# EAGLE design v1 (EAGLE 8.3.2)
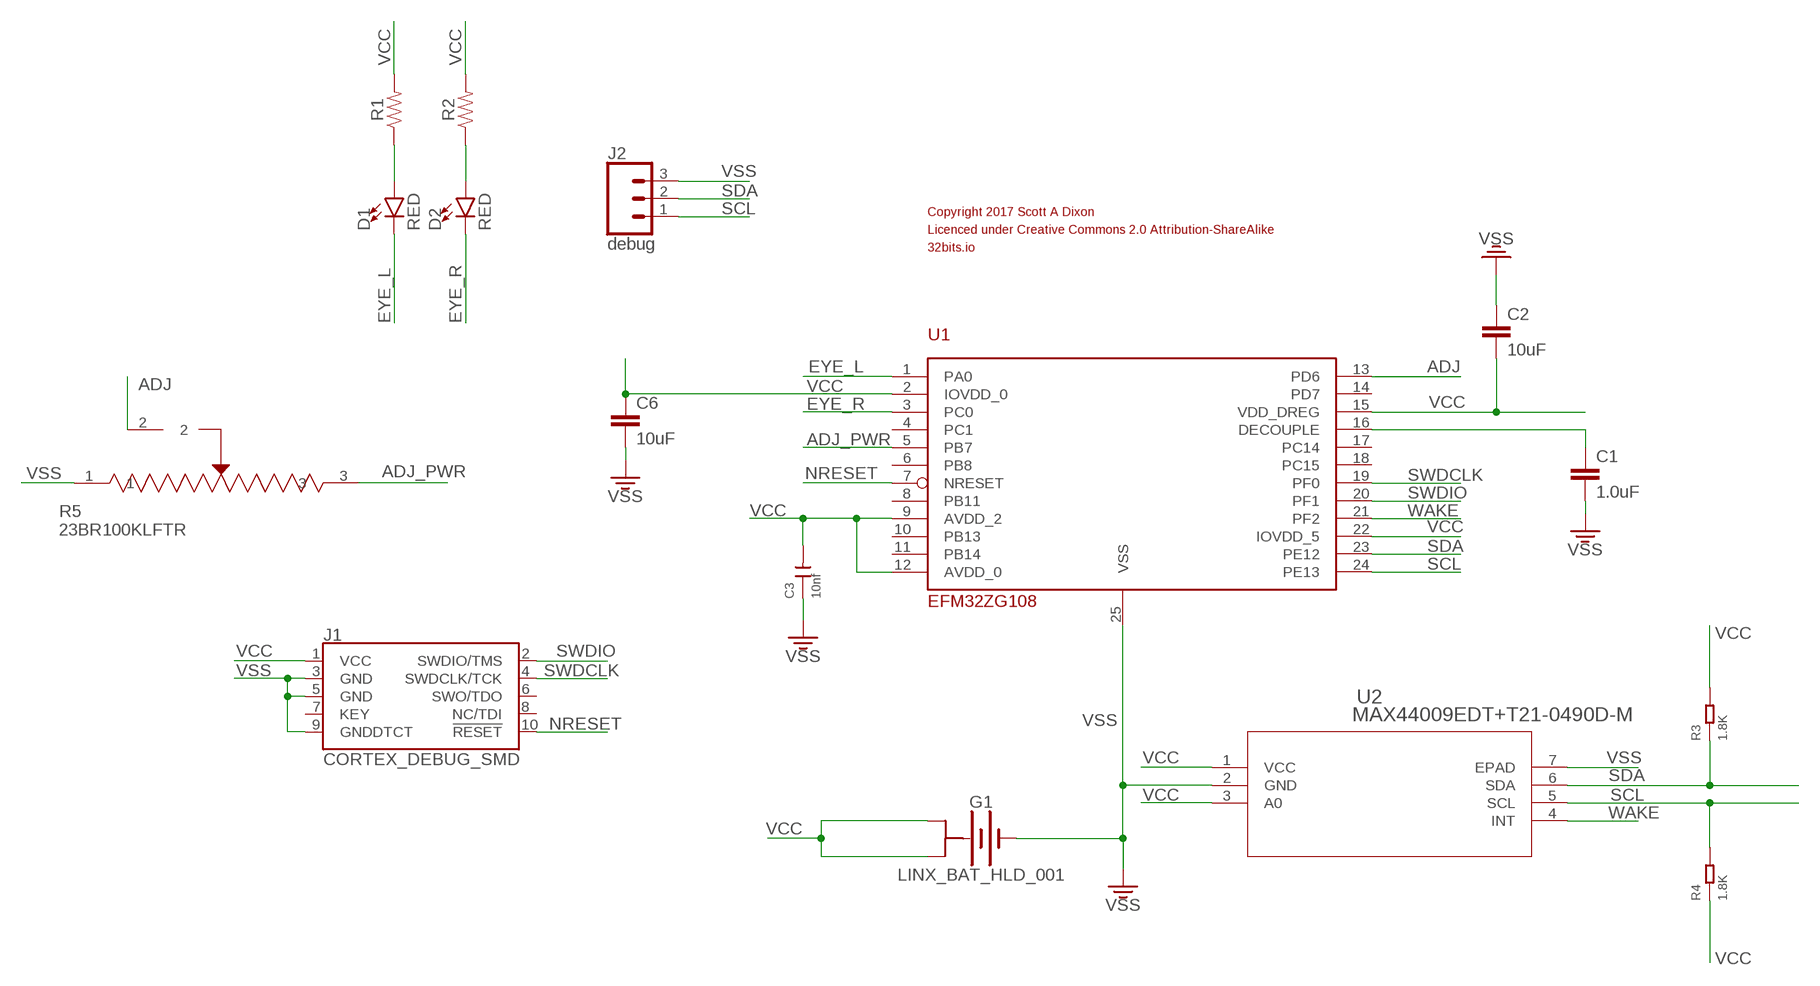
[diagram p0: schematic, sheet 1]

## Parts
C1  1.0uF  1.0UF-0603-16V-10%  [0603]
C2  10uF  10UF-0805-10V-10%  [0805]
C3  10nf  CERAMIC-10NF-50V-10%-X7R(0402)  [C0402]
C6  10uF  10UF-0805-10V-10%  [0805]
D1  RED  LED-RED1206  [LED-1206]
D2  RED  LED-RED1206  [LED-1206]
G1  LINX_BAT_HLD_001  [BATT-RETAINER-20MM]
J1  CORTEX_DEBUG_SMD  [SAMTECH_FTSH-105-01]
J2  debug  CONN_03  [1X03]
R1  68OHM-0603-1/10W-1%  [0603]
R2  68OHM-0603-1/10W-1%  [0603]
R3  1.8K  SMD-RES-1K-5%-1/16W(0402)  [R0402]
R4  1.8K  SMD-RES-1K-5%-1/16W(0402)  [R0402]
R5  23BR100KLFTR  [SOT_23BR100KLFTR]
U1  EFM32ZG108  [QFN-24]
U2  MAX44009EDT+T21-0490D-M  [21-0490D-M]
U$1  COPYRIGHT  [COPYRIGHT]

## Nets
ADJ: R5.2 U1.13(PD6)
ADJ_PWR: R5.3 U1.5(PB7)
DCP: C1.1 U1.16(DECOUPLE)
EYE_L: D1.C U1.1(PA0)
EYE_R: D2.C U1.3(PC0)
N$2: D2.A R2.1
N$3: D1.A R1.1
NRESET: J1.10(!RESET) U1.7(NRESET)
SCL: J2.1 R4.2 U1.24(PE13) U2.5(SCL)
SDA: J2.2 R3.1 U1.23(PE12) U2.6(SDA)
SWDCLK: J1.4(SWDCLK/TCK) U1.19(PF0)
SWDIO: J1.2(SWDIO/TMS) U1.20(PF1)
VCC: C2.2 C3.2 C6.1 G1.P$1(+$1) G1.P$2(+$1) G1.P$3(+$2) G1.P$4(+$2) J1.1(VCC) R1.2 R2.2 R3.2 R4.1 U1.2(IOVDD_0) U1.9(AVDD_2) U1.12(AVDD_0) U1.15(VDD_DREG) U1.22(IOVDD_5) U2.1(VCC) U2.3(A0)
VSS: C1.2 C2.1 C3.1 C6.2 G1.P$0(-) J1.3(GND) J1.5(GND) J1.9(GNDDTCT) J2.3 R5.1 U1.25(VSS) U2.2(GND) U2.7(EPAD)
WAKE: U1.21(PF2) U2.4(INT)
Unconnected: J1.6(SWO/TDO) J1.7(KEY) J1.8(NC/TDI) U1.4(PC1) U1.6(PB8) U1.8(PB11) U1.10(PB13) U1.11(PB14) U1.14(PD7) U1.17(PC14) U1.18(PC15)

## Library data of the parts
C1 = SparkFun-Capacitors:1.0UF: 1µF ceramic capacitors A capacitor is a passive two-terminal electrical component used to store electrical energy temporarily in an electric field.; PROD_ID: CAP-00868
C2 C6 = SparkFun-Capacitors:10UF: 10.0µF ceramic capacitors A capacitor is a passive two-terminal electrical component used to store electrical energy temporarily in an electric field.; PROD_ID: CAP-11330
C3 = Seeed-Capacitor:CERAMIC-10NF-50V-10%-X7R(0402): 302010006; MPN: CC0402KRX7R9BB103
D1 D2 = SparkFun-LED:LED-RED: Red SMD LED Used in manufacturing of most products at SparkFun Packages: 0603 - SMD 0603 package [Product Link] <http://docs.avagotech.com/docs/AV02-0551EN> 0603 SMART - SMD 0603 SMART package ( more efficient and expensive)[Product Link] <http://www.osram-os.com/Graphics/XPic2/00077099_0.pdf> 1206 - SMD1206 package [Product Link] <https://www.sparkfun.com/datasheets/DevTools/LilyPad/Q150OVS4.pdff> SparkFun Products: Pro Mini 328 -5V <https://www.sparkfun.com/products/821> RedBoard <https://www.sparkfun.com/products/12757> IOIO-OTG <https://www.sparkfun.com/products/13613>; PROD_ID: DIO-09912
G1 = boneyard:LINX_BAT_HLD_001
J1 = SparkFun-Connectors:CORTEX_DEBUG: Cortex Debug Connector - 10 pin Supports JTAG debug, Serial Wire debug, and Serial Wire Viewer. PTH and SMD connector options available. General Connector Information <http://infocenter.arm.com/help/topic/com.arm.doc.faqs/attached/13634/cortex_debug_connectors.pdf> Products: PTH Connector <http://www.digikey.com/product-detail/en/cnc-tech/3220-10-0100-00/1175-1627-ND/3883661> -via Digi-Key SparkFun PSoc <https://www.sparkfun.com/products/13229> SparkFun T <https://www.sparkfun.com/products/13810>
J2 = SparkFun-Connectors:CONN_03: Multi connection point. Often used as Generic Header-pin footprint for 0.1 inch spaced/style header connections On any of the 0.1 inch spaced packages, you can populate with these: Break Away Headers - Straight <https://www.sparkfun.com/products/116> (PRT-00116) Break Away Male Headers - Right Angle <https://www.sparkfun.com/products/553> (PRT-00553) Female Headers <https://www.sparkfun.com/products/115> (PRT-00115) Break Away Headers - Machine Pin <https://www.sparkfun.com/products/117> (PRT-00117) Break Away Female Headers - Swiss Machine Pin <https://www.sparkfun.com/products/743> (PRT-00743) Stackable Header - 3 Pin (Female, 0.1") <https://www.sparkfun.com/products/13875> (PRT-13875) For SCREWTERMINALS and SPRING TERMINALS visit here: Screw Terimnals on SparkFun.com <https://www.sparkfun.com/search/results?term=Screw+Terminals> (5mm/3.5mm/2.54mm spacing) This device is also useful as a general connection point to wire up your design to another part of your project. Our various solder wires solder well into these plated through hole pads. Hook-Up Wire - Assortment (Stranded, 22 AWG) <https://www.sparkfun.com/products/11375> (PRT-11375) Hook-Up Wire - Assortment (Solid Core, 22 AWG) <https://www.sparkfun.com/products/11367> (PRT-11367) View the entire wire category on our website here <https://www.sparkfun.com/categories/141> Special notes: Molex polarized connector foot print use with SKU : PRT-08232 with associated crimp pins and housings.
R1 R2 = SparkFun-Resistors:68OHM: 68Ω resistor A resistor is a passive two-terminal electrical component that implements electrical resistance as a circuit element. Resistors act to reduce current flow, and, at the same time, act to lower voltage levels within circuits. - Wikipedia
R3 R4 = Seeed-Resistor:SMD-RES-1K-5%-1/16W(0402): 301010006; MPN: RC0402JR-071KL; VALUE: 1K
R5 = boneyard:23BR100KLFTR; MANUFACTURER_PART_NUMBER: 23BR100KLFTR; VENDOR: Bi Technologies
U1 = boneyard:EFM32ZG108: EFM32 ARM Cortex-M0+ CPU platform up to 24 MHz 32/16/8/4 KB Flash 4/4/2/2 KB RAM
U2 = boneyard:MAX44009EDT+T; MANUFACTURER_PART_NUMBER: MAX44009EDT+T; VENDOR: Maxim Integrated Products
U$1 = boneyard:COPYRIGHT: Silkscreen and copyright for the damned board.

## Board
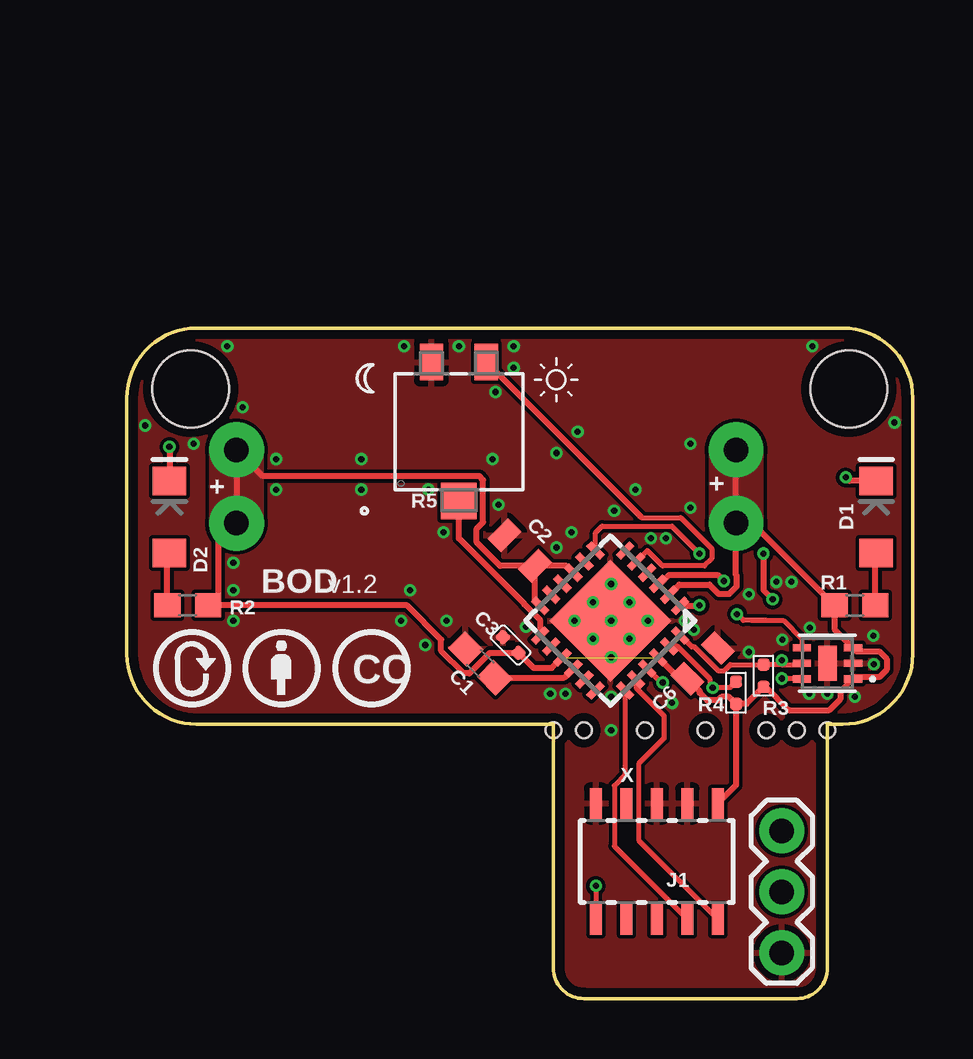
[diagram p1: board, top side]
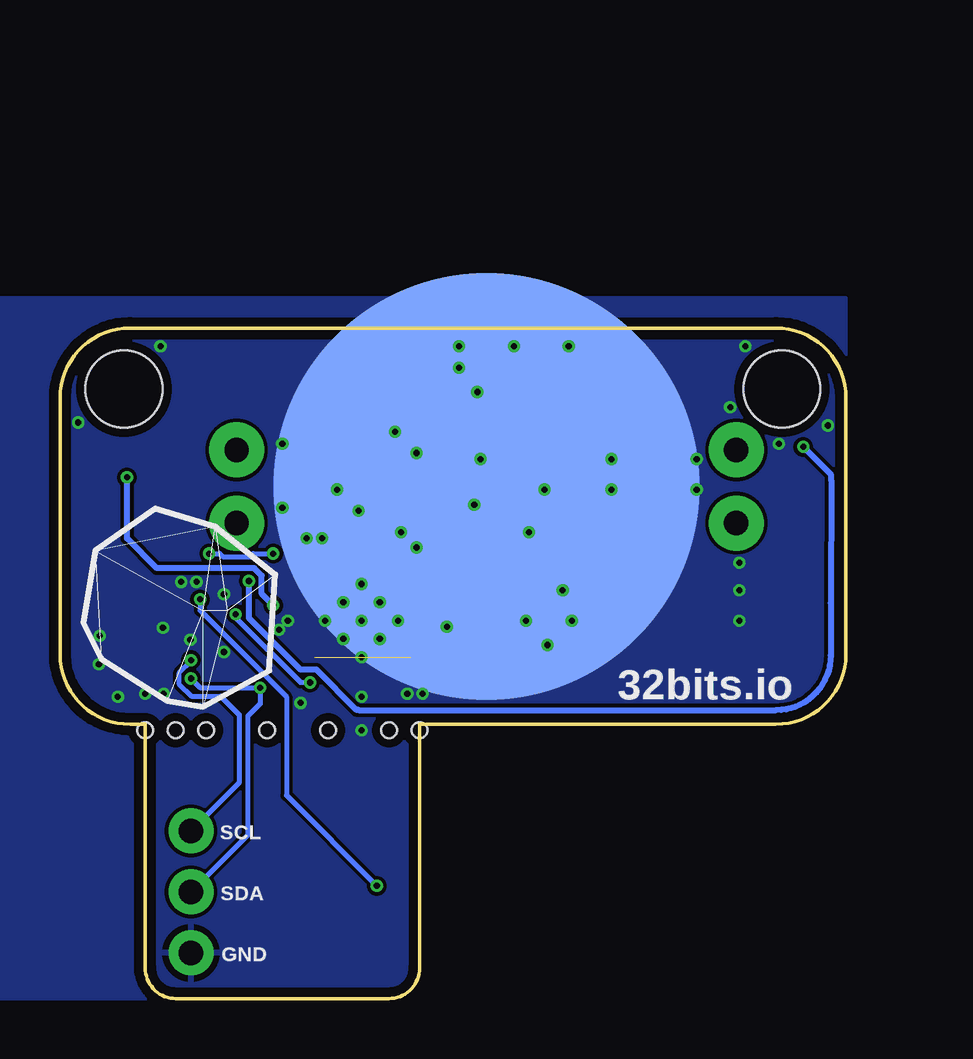
[diagram p2: board, bottom side, seen from below]

Size 32.77 x 27.94 mm. Coordinates in mm from the lower left corner, seen from the top.
Outline: 0,25.02 0,14.35 arc90 2.92,11.43 17.78,11.43 17.78,1.27 arc90 19.05,0 27.94,0 arc90 29.21,1.27 29.21,11.43 29.84,11.43 arc90 32.77,14.35 32.77,25.02 arc90 29.84,27.94 2.92,27.94 arc90 0,25.02
Copper layers (1*16): Top 0.035559375mm / dielectric 1.6mm / Bottom 0.035559375mm
Design rules "oshpark-2layer-tented": minimum track width 6mil, minimum drill 10mil, track to track 6mil, track to pad 6mil, pad to pad 6mil, via to via 6mil, smd to smd 6mil, copper to edge 15mil, drill to drill 6mil, minimum pad ring 5mil, minimum via ring 5mil, stop-mask expansion 2.5mil, vias tented up to drill 20mil, thermal gap 10mil
Holes 3.2 mm at 2.67,25.4 30.1,25.4
Holes 0.65 mm at 24.13,11.18 26.67,11.18 27.94,11.18 29.21,11.18 17.78,11.18 21.59,11.18 19.05,11.18

### Footprints (pad centres in the part's own frame; a part is rotated, then mirrored left to right if it is on the bottom)
0603 = smd 1.1 x 1: 1 -0.85,0; 2 0.85,0
0805 = smd 0.8 x 1.2: 1 -0.9,0; 2 0.9,0
C0402 = smd 0.5 x 0.5: 1 0,0.463; 2 0,-0.463
LED-1206 = smd 1.2 x 1.4: A -1.5,0; C 1.5,0
BATT-RETAINER-20MM = smd 17.78 x 17.78: P$0 10.414,-1.524 | drill 1.016 pad 2.286: P$1 0,0; P$2 0,-3.048; P$3 20.828,0; P$4 20.828,-3.048
SAMTECH_FTSH-105-01 = smd 0.508 x 1.27: 1 -2.54,-2.413; 2 -2.54,2.413; 3 -1.27,-2.413; 4 -1.27,2.413; 5 0,-2.413; 6 0,2.413; 7 1.27,-2.413; 8 1.27,2.413; 9 2.54,-2.413; 10 2.54,2.413
1X03 = drill 1.016 pad 1.88: 1 0,0; 2 2.54,0; 3 5.08,0
R0402 = smd 0.5 x 0.5: 1 0,0.463; 2 0,-0.463
SOT_23BR100KLFTR = smd 0.965 x 1.524: 1 -1.143,2.896; 3 1.143,2.896 | smd 1.473 x 1.524: 2 0,-2.896
QFN-24 = smd 0.8 x 0.3: 1 0.04,-0.915; 2 0.04,-1.565; 3 0.04,-2.215; 4 0.04,-2.865; 5 0.04,-3.515; 6 0.04,-4.165; 13 5.04,-4.165; 14 5.04,-3.515; 15 5.04,-2.865; 16 5.04,-2.215; 17 5.04,-1.565; 18 5.04,-0.915 | smd 0.3 x 0.8: 7 0.915,-5.04; 8 1.565,-5.04; 9 2.215,-5.04; 10 2.865,-5.04; 11 3.515,-5.04; 12 4.165,-5.04; 19 4.165,-0.04; 20 3.515,-0.04; 21 2.865,-0.04; 22 2.215,-0.04; 23 1.565,-0.04; 24 0.915,-0.04 | smd 3.6 x 3.6: 25 2.54,-2.54
21-0490D-M = smd 0.762 x 0.305: 1 -1.067,0.65; 2 -1.067,0; 3 -1.067,-0.65; 4 1.067,-0.65; 5 1.067,0; 6 1.067,0.65 | smd 0.762 x 1.448: 7 0,0

### Placement (x,y rotation side)
C1  14.73,13.97 135 top
C2  16.38,18.67 315 top
C3  16,14.73 45 top
C6  24,13.97 45 top
D1  31.24,20.07 90 top
D2  1.78,20.07 90 top
G1  25.4,22.86 0 bottom
J1  22.1,5.71 180 top
J2  27.3,6.99 270 top
R1  30.35,16.38 180 top
R2  2.54,16.38 0 top
R3  25.4,12.75 0 top
R4  26.54,13.45 180 top
R5  13.84,23.62 0 top
U1  23.75,15.75 225 top
U2  29.21,13.97 180 top
U$1  6.48,13.72 0 top
U$2  [32BITS_LOGO]  30.61,11.94 0 bottom

### Tracks (layer width: path | path; a pad name or v marks a point on that pad's centre or on a via)
ADJ
  Top 0.254: U1.13 17.24,15.76 16.57,16.43 16.57,16.45 13.84,19.18 R5.2
ADJ_PWR
  Top 0.203: 21.39,20.12 21.46,20.04 23.1,20.04 24.38,18.75 24.38,18.33 24.09,18.03 22.33,18.03 21.7,18.67 U1.5
  Top 0.254: 21.44,20.07 21.39,20.12 R5.3
DCP
  Top 0.254: C1.1 18.24,13.37 U1.16
EYE_L  (via drill 0.25)
  Top 0.254: U1.1 23.86,16.37 v23.88,16.38 | D1.C 30.12,21.57 v29.97,21.72
  Bottom 0.254: v23.88,16.38 24.36,16.87 24.36,17.62 24.67,17.93 28.73,17.93 29.97,19.18 v29.97,21.72
EYE_R  (via drill 0.25)
  Top 0.254: v1.78,22.99 D2.C | U1.3 22.24,17.29 22.61,17.65 24.64,17.65 v24.89,17.4
  Bottom 0.254: v24.89,17.4 24.89,15.86 22.74,13.7 22.08,13.7 20.41,12.04 20.34,12.04 20.32,12.01 | 20.32,12.01 2.92,12.01 arc-90 0.64,14.3 0.64,16.49 0.62,21.59 0.62,21.83 v1.78,22.99 | 20.32,12.01 20.38,12.01
N$2
  Top 0.254: R2.1 1.69,18.48 D2.A
N$3
  Top 0.254: R1.1 31.2,18.53 D1.A
NRESET  (via drill 0.25)
  Top 0.203: v19.56,4.7 J1.10 | U1.7 19.54,19.41 19.81,19.68 22.73,19.68 v23.88,18.54
  Top 0.254: 19.54,18.69 U1.7 | v26.54,18.54 26.54,17.02 v26.92,16.64
  Bottom 0.203: v19.56,4.7 23.32,8.46 23.32,12.57 26.92,16.17 v26.92,16.64 | v26.54,18.54 26.11,18.54 25.98,18.41 24.82,18.41 24.69,18.54 v23.88,18.54
SCL  (via drill 0.25)
  Top 0.203: U1.24 23.55,14.65 23.67,14.65 24.68,13.64 24.89,13.64 25.16,13.91 R4.2 27.31,13.91 | 27.31,13.91 28.09,13.91 U2.5 | v27.3,14.1 27.3,13.92 27.31,13.91
  Bottom 0.203: v27.3,14.1 27.3,14.05 27.81,13.54 27.81,13.12 27.29,12.6 26.06,12.6 25.29,11.83 25.29,9 J2.1
SDA  (via drill 0.25)
  Top 0.203: 28.13,13.34 U2.6 27.32,13.32 v27.3,13.34 | R3.1 25.15,12.95 v24.42,12.95 24.33,13.05 24.33,13.3 22.95,14.67 U1.23
  Bottom 0.203: v27.3,13.34 26.92,12.95 v24.42,12.95 24.42,12.28 24.94,11.77 24.94,6.81 J2.2
SWDCLK
  Top 0.203: U1.19 20.78,9.32 20.32,8.87 20.32,6.35 J1.4
SWDIO
  Top 0.203: U1.20 21.23,12.94 22.4,11.78 22.4,10.84 21.34,9.78 21.34,6.6 J1.2
  Top 0.254: 21.25,13.29 U1.20
VCC  (1 unrouted)
  Top 0.254: C6.1 23.16,13.21 | 18.15,14.21 U1.15 17.73,13.78 16.96,13.78 C3.2 15.14,14.4 14.28,13.55 14.05,13.55 13.11,14.49 13.11,14.96 11.68,16.38 R2.2 3.81,16.38 3.81,19.05 G1.P$4 G1.P$3 5.66,21.77 14.7,21.77 14.86,21.6 14.86,19.85 14.59,19.58 14.59,19.01 15.56,18.03 C2.2 | R3.2 25.84,12.28 R4.1 26.63,12.99 27.61,12.01 29.29,12.01 29.74,12.47 29.74,12.79 U2.1 30.36,13.4 31.36,13.4 31.67,13.71 31.67,14.15 31.36,14.46 30.43,14.46 U2.3 29.5,15.39 R1.2 26.07,19.81 G1.P$2 | C2.2 18.33,18.03 U1.9 | C2.2 17.02,16.59 U1.12 | U1.22 23.03,13.33 C6.1 | R3.2 25.11,12.57 24.8,12.57 24.64,12.42 24.2,12.42 23.89,12.73 23.89,12.81 C6.1 | R3.2 25.4,8.89 J1.1 | 22.91,17.12 U1.2 23.03,17.25 24.29,17.25 24.67,16.87 25.11,16.87 25.43,17.18 25.43,17.62 25.4,17.64 G1.P$2 | G1.P$2 G1.P$1
  pour Top: 3.56,22.86 5.59,22.86 5.59,19.68 3.56,19.68
  pour Top: 24.38,22.86 26.42,22.86 26.42,19.68 24.38,19.68
VSS  (via drill 0.25)
  Top 0.152: 29.35,14.62 29.21,14.48 U2.7
  other vias: 29.21,12.7 23.27,15.75 20.19,15.75 19.43,16.51 18.67,15.75 20.19,17.27 20.95,16.51 19.43,14.99 20.19,14.22 20.95,14.99 21.72,15.75 21.21,21.21 4.19,27.18 0.76,23.88 28.57,27.18 32,24 4.45,18.16 4.83,24.64 20.19,12.57 2.79,23.11 28.45,12.7 23.63,15.37 27.33,14.95 23.5,20.45 18.29,12.7 17.65,12.7 9.78,22.48 11.56,27.18 6.22,22.48 13.84,27.18 16.13,27.18 15.24,22.48 17.91,18.8 18.54,19.43 23.5,23.11 11.43,15.75 12.45,14.73 13.34,15.75 11.81,17.02 22.48,19.18 21.84,19.18 31.14,13.93 28.47,15.46 27.71,17.36 25.93,16.85 25.93,14.44 27.08,17.36 4.45,17.02 6.22,21.21 12.57,21.21 9.78,21.21 13.21,19.43 16.64,15.49 4.45,15.75 20.32,20.32 15.49,20.57 15.37,25.27 17.91,22.73 18.8,23.62 16.13,26.29 30.35,12.57 31.11,15.11 22.73,12.32 20.19,11.18
  pour Top (rank 2): 0,0 54.61,0 54.61,30.48 0,30.48
  pour Bottom: 0,0 53.34,0 53.34,29.21 0,29.21
WAKE  (via drill 0.25)
  Top 0.203: U1.21 22.27,13.17 v22.34,13.17 | 26.06,15.76 26.67,15.76 | 26.67,15.76 27.37,15.76 28.14,14.98 U2.4 | 26.67,15.76 25.7,15.76 v25.44,16.02
  Bottom 0.203: v22.34,13.17 22.74,13.17 25.44,15.87 v25.44,16.02

### Text on the board
tNames: + | + | BOD | v1.2 | X
bNames: 32bits.io | SCL | SDA | GND